# EAGLE design Aux Board (EAGLE 6.5.0)
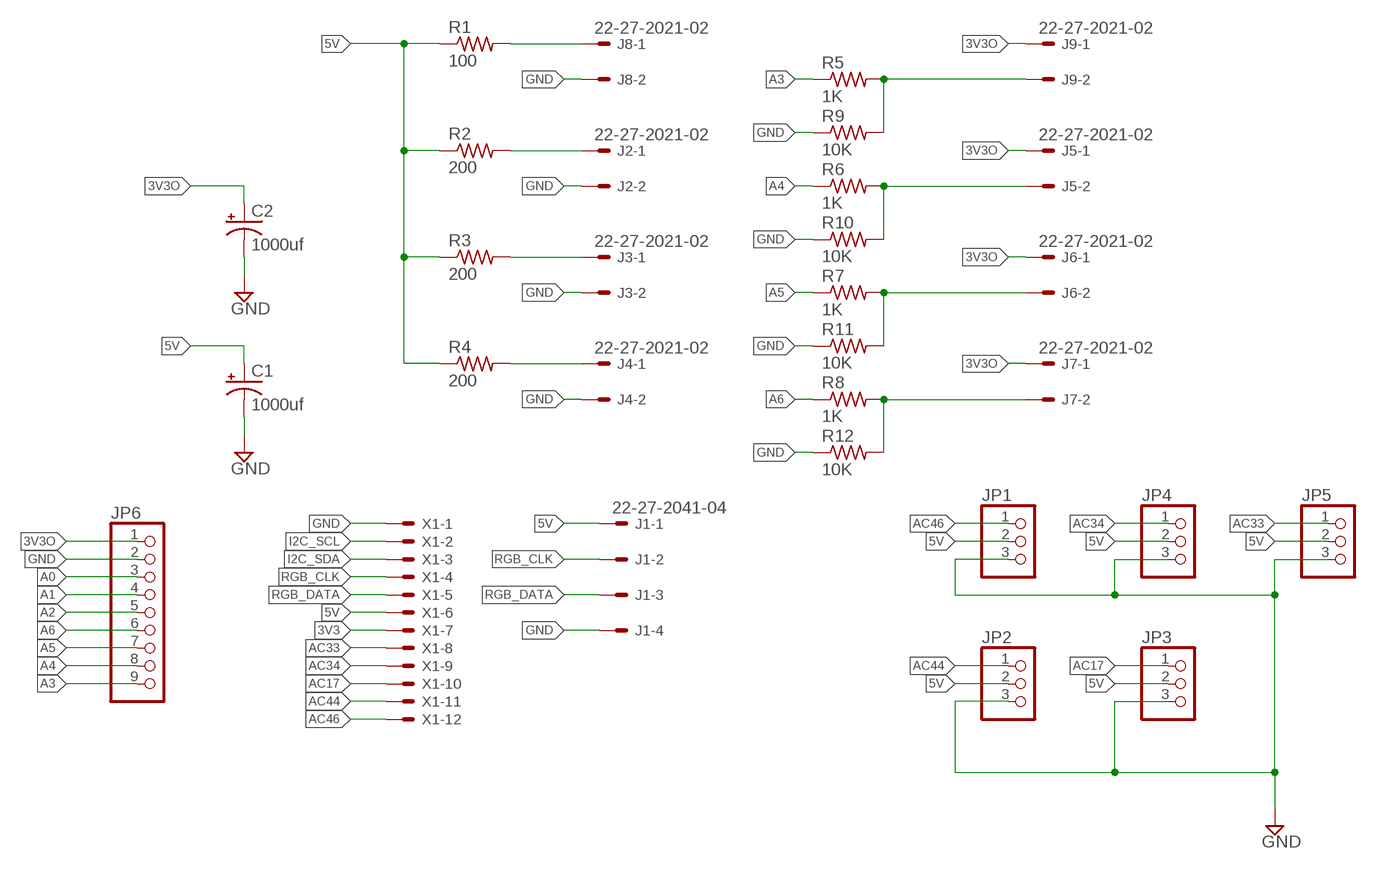
[diagram p0: schematic, sheet 1]

## Parts
C1  1000uf  CPOL-USE5-8.5  [E5-8,5]
C2  1000uf  CPOL-USE5-8.5  [E5-8,5]
J1  22-27-2041-04  [6410-04]
J2  22-27-2021-02  [6410-02]
J3  22-27-2021-02  [6410-02]
J4  22-27-2021-02  [6410-02]
J5  22-27-2021-02  [6410-02]
J6  22-27-2021-02  [6410-02]
J7  22-27-2021-02  [6410-02]
J8  22-27-2021-02  [6410-02]
J9  22-27-2021-02  [6410-02]
JP1  PINHD-1X3  [1X03]
JP2  PINHD-1X3  [1X03]
JP3  PINHD-1X3  [1X03]
JP4  PINHD-1X3  [1X03]
JP5  PINHD-1X3  [1X03]
JP6  PINHD-1X9  [1X09-BIG]
R1  100  R-US_0207/10  [0207/10]
R2  200  R-US_0207/10  [0207/10]
R3  200  R-US_0207/10  [0207/10]
R4  200  R-US_0207/10  [0207/10]
R5  1K  R-US_0207/10  [0207/10]
R6  1K  R-US_0207/10  [0207/10]
R7  1K  R-US_0207/10  [0207/10]
R8  1K  R-US_0207/10  [0207/10]
R9  10K  R-US_0207/10  [0207/10]
R10  10K  R-US_0207/10  [0207/10]
R11  10K  R-US_0207/10  [0207/10]
R12  10K  R-US_0207/10  [0207/10]
X1  KK-156-12  [KK-156-12]

## Nets
3V3: X1.7
3V3O: C2.+ J5.1 J6.1 J7.1 J9.1 JP6.1
5V: C1.+ J1.1 JP1.2 JP2.2 JP3.2 JP4.2 JP5.2 R1.1 R2.1 R3.1 R4.1 X1.6
A0: JP6.3
A1: JP6.4
A2: JP6.5
A3: JP6.9 R5.1
A4: JP6.8 R6.1
A5: JP6.7 R7.1
A6: JP6.6 R8.1
AC17: JP3.1 X1.10
AC33: JP5.1 X1.8
AC34: JP4.1 X1.9
AC44: JP2.1 X1.11
AC46: JP1.1 X1.12
GND: C1.- C2.- J1.4 J2.2 J3.2 J4.2 J8.2 JP1.3 JP2.3 JP3.3 JP4.3 JP5.3 JP6.2 R9.1 R10.1 R11.1 R12.1 X1.1
I2C_SCL: X1.2
I2C_SDA: X1.3
N$1: J7.2 R8.2 R12.2
N$3: J6.2 R7.2 R11.2
N$5: J5.2 R6.2 R10.2
N$8: J2.1 R2.2
N$9: J3.1 R3.2
N$11: J4.1 R4.2
N$14: J9.2 R5.2 R9.2
N$16: J8.1 R1.2
RGB_CLK: J1.2 X1.4
RGB_DATA: J1.3 X1.5

## Library data of the parts
C1 C2 = rcl:CPOL-US: POLARIZED CAPACITOR, American symbol
J1 = con-molex:22-?-04: CONNECTOR wire to board 2.54 mm (.1 inch) pitch header; OC_FARNELL: unknown; OC_NEWARK: unknown
J2-J9 = con-molex:22-?-02: CONNECTOR wire to board 2.54 mm (.1 inch) pitch header; OC_FARNELL: unknown; OC_NEWARK: unknown
JP1-JP5 = adafruit:PINHD-1X3: PIN HEADER
JP6 = adafruit:PINHD-1X9: Pin header 1x10 0.1" spacing With round pins
R1-R12 = resistor:R-US_: RESISTOR, American symbol
X1 = con-molex:KK-156-12: KK 156 HEADER Source: http://www.molex.com/pdm_docs/sd/026604100_sd.pdf; OC_FARNELL: unknown; OC_NEWARK: unknown

## Board
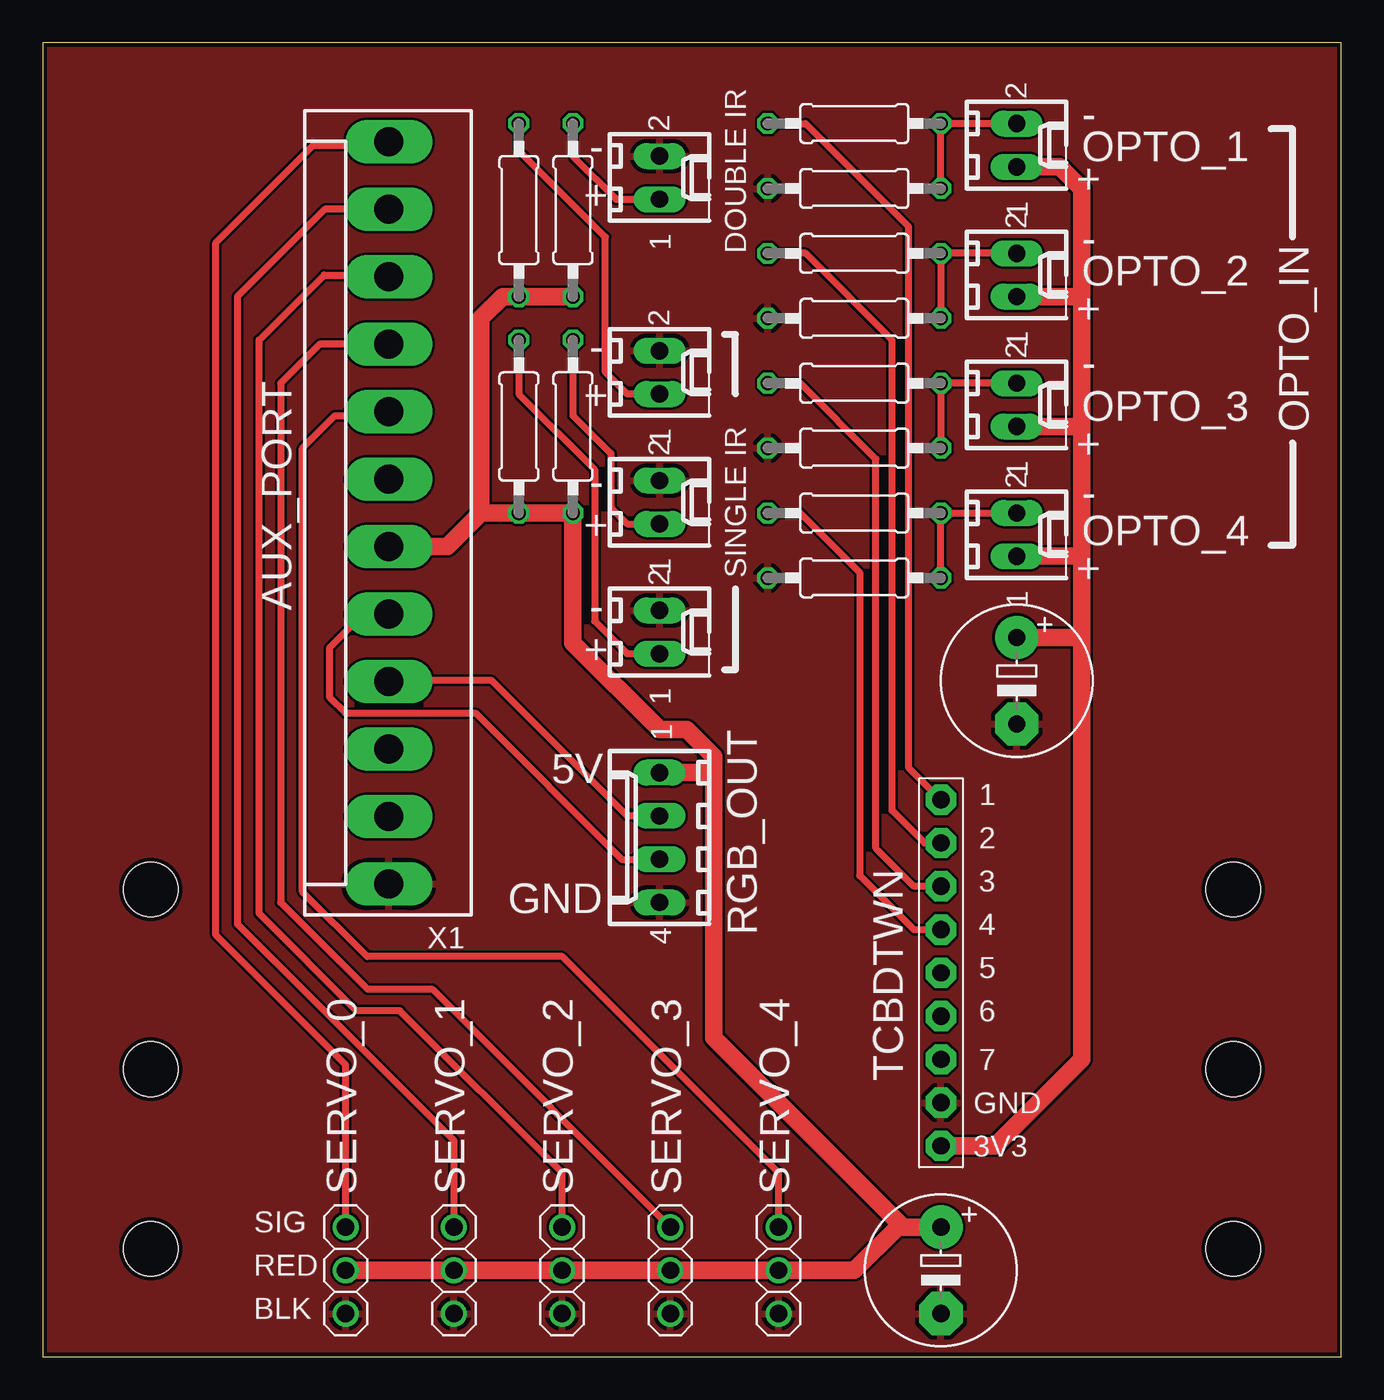
[diagram p1: board, top side]
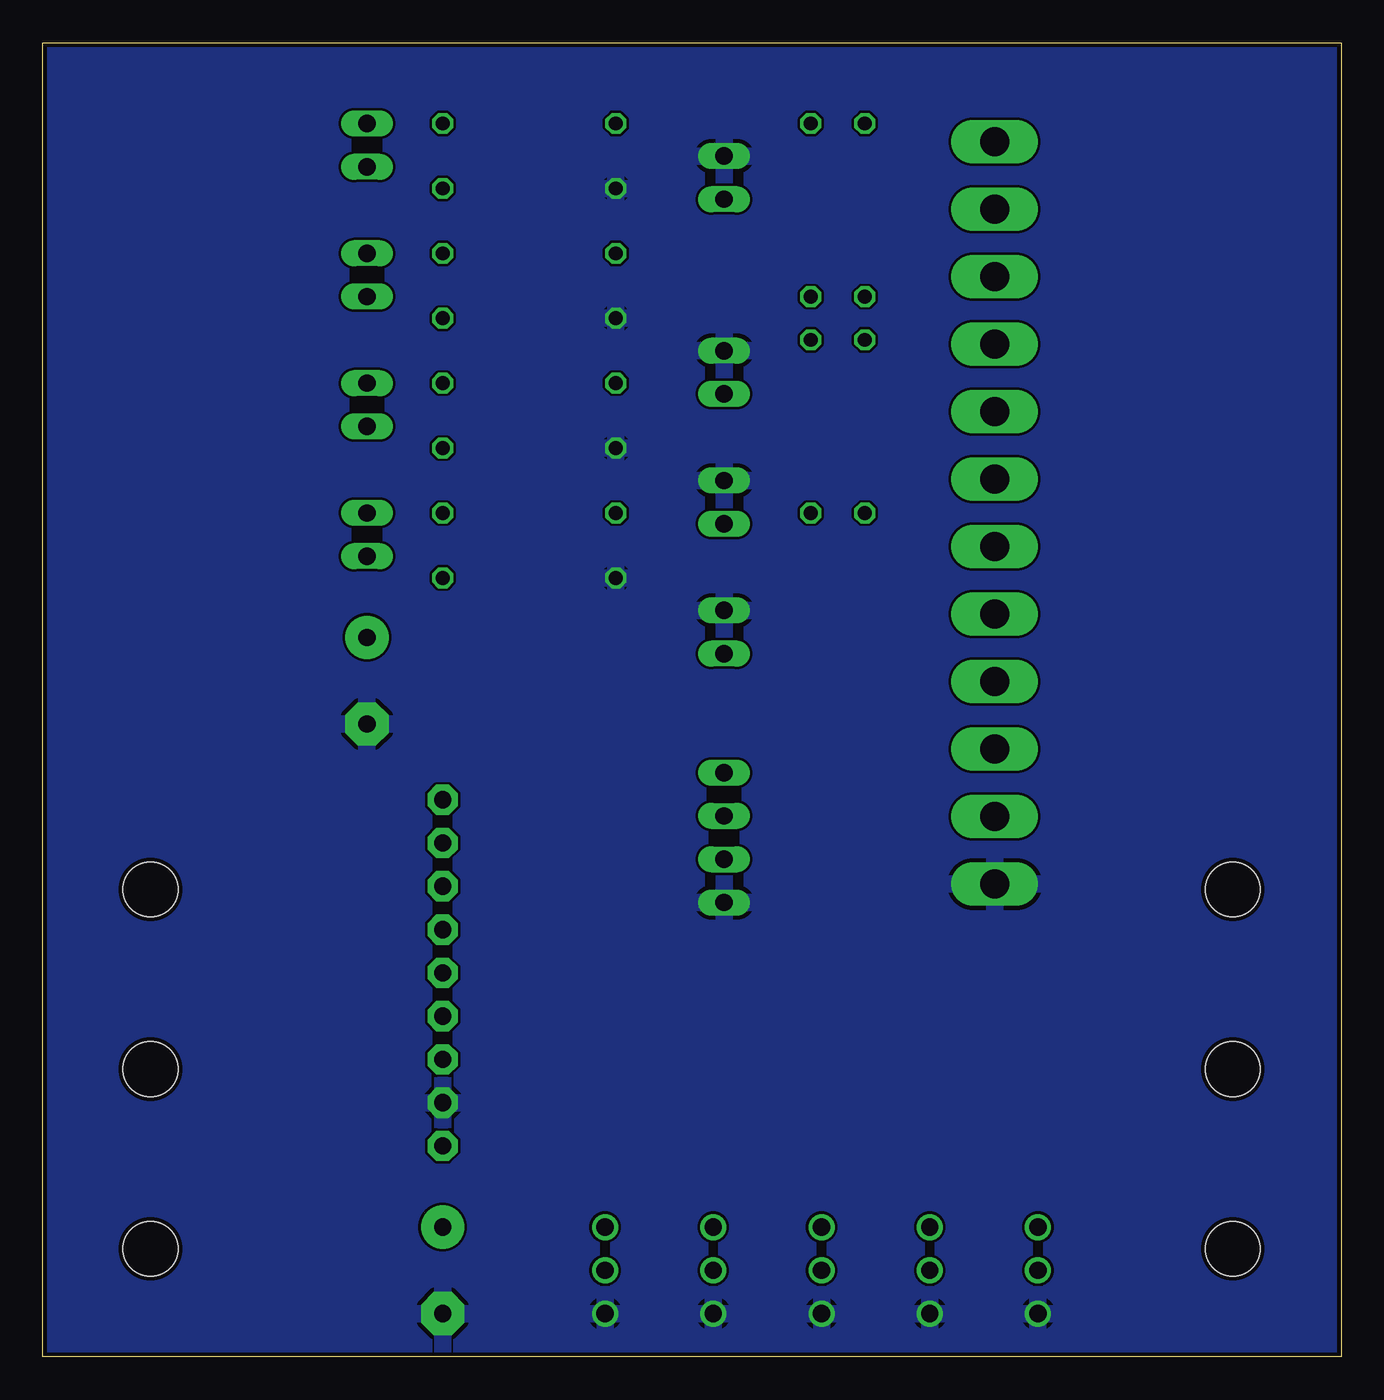
[diagram p2: board, bottom side, seen from below]

Size 76.18 x 77.14 mm. Coordinates in mm from the lower left corner, seen from the top.
Outline: 0,0 76.18,0 76.18,77.14 0,77.14 0,0
Copper layers (1*2*15*16): Top 0.035mm / dielectric 0.2mm / Route2 0.0175mm / dielectric 1.1mm / Route15 0.0175mm / dielectric 0.2mm / Bottom 0.035mm
Design rules "SeeedStudio_DRU_no_angle_20130527": minimum track width 6mil, minimum drill 12mil, track to track 6mil, track to pad 6mil, pad to pad 6mil, via to via 6mil, smd to smd 0mil, copper to edge 10mil, drill to drill 10mil, minimum pad ring 6mil, minimum via ring 6mil, stop-mask expansion 2mil, vias tented up to drill 25mil, thermal gap 10mil
Holes 3.2 mm at 6.35,6.35 6.35,16.89 6.35,27.43 69.85,6.35 69.85,16.89 69.85,27.43

### Footprints (pad centres in the part's own frame; a part is rotated, then mirrored left to right if it is on the bottom)
E5-8,5 = drill 1.016 pad 2.54: + -2.54,0 | drill 1.016 pad 2.54 octagon: - 2.54,0
6410-04 = drill 1.016 long: 1 3.81,0; 2 1.27,0; 3 -1.27,0; 4 -3.81,0
6410-02 = drill 1.016 long: 1 1.27,0; 2 -1.27,0
1X03 = drill 1.016: 1 -2.54,0; 2 0,0; 3 2.54,0
1X09-BIG = drill 1.016 pad 1.778 octagon: 1 -10.16,0; 2 -7.62,0; 3 -5.08,0; 4 -2.54,0; 5 0,0; 6 2.54,0; 7 5.08,0; 8 7.62,0; 9 10.16,0
0207/10 = drill 0.813 octagon: 1 -5.08,0; 2 5.08,0
KK-156-12 = drill 1.7 pad 2.184 long: 1 -21.78,0; 2 -17.82,0; 3 -13.86,0; 4 -9.9,0; 5 -5.94,0; 6 -1.98,0; 7 1.98,0; 8 5.94,0; 9 9.9,0; 10 13.86,0; 11 17.82,0; 12 21.78,0

### Placement (x,y rotation side)
C1  52.7,5.08 270 top
C2  57.15,39.69 270 top
J1  36.2,30.48 90 top
J2  36.2,57.78 270 top
J3  36.2,42.55 270 top
J4  36.2,50.16 270 top
J5  57.15,63.5 270 top
J6  57.15,55.88 270 top
J7  57.15,48.26 270 top
J8  36.2,69.22 270 top
J9  57.15,71.12 270 top
JP1  17.78,5.08 270 top
JP2  24.13,5.08 270 top
JP3  30.48,5.08 270 top
JP4  36.83,5.08 270 top
JP5  43.18,5.08 270 top
JP6  52.7,22.54 90 top
R1  31.11,67.31 90 top
R2  27.94,67.31 90 top
R3  27.94,54.61 90 top
R4  31.11,54.61 90 top
R5  47.62,72.39 0 top
R6  47.62,64.77 0 top
R7  47.62,57.15 0 top
R8  47.62,49.53 0 top
R9  47.62,68.58 0 top
R10  47.62,60.96 0 top
R11  47.62,53.34 0 top
R12  47.62,45.72 0 top
X1  20.32,49.53 90 top

### Tracks (layer width: path | path; a pad name or v marks a point on that pad's centre or on a via)
3V3O
  Top 1.016: JP6.1 55.88,12.38 60.96,17.46 60.96,42.23 | 60.96,42.23 60.96,46.67 | 60.96,46.67 60.96,54.29 | 60.96,54.29 60.96,62.23 | 60.96,62.23 60.96,68.58 59.69,69.85 J9.1 | J5.1 60.96,62.23 | J6.1 60.64,54.61 60.96,54.29 | J7.1 60.64,46.99 60.96,46.67 | C2.+ 60.96,42.23
5V
  Top 1.016: R1.1 R2.1 26.99,62.23 25.72,60.96 25.72,49.53 | X1.6 23.74,47.55 25.72,49.53 | 25.72,49.53 R3.1 R4.1 31.11,41.91 36.2,36.83 37.78,36.83 39.37,35.24 39.37,34.29 | 39.37,34.29 39.37,18.73 50.48,7.62 | 50.48,7.62 C1.+ | 50.48,7.62 50.16,7.62 47.62,5.08 JP5.2 | J1.1 39.37,34.29 | JP5.2 JP4.2 | JP5.2 JP3.2 JP2.2 JP1.2
A3
  Top 0.406: R5.1 44.77,72.39 50.8,66.36 50.8,34.61 JP6.9
A4
  Top 0.406: JP6.8 51.75,30.16 49.85,32.07 49.85,59.69 44.77,64.77 R6.1
A5
  Top 0.406: JP6.7 51.12,27.62 48.9,29.84 48.9,52.7 44.45,57.15 R7.1
A6
  Top 0.406: R8.1 44.45,49.53 47.94,46.04 47.94,28.26 51.12,25.08 JP6.6
AC17
  Top 0.406: JP3.1 30.48,10.79 20.95,20.32 18.41,20.32 12.7,26.04 12.7,59.69 16.51,63.5 20.21,63.5 X1.10
AC33
  Top 0.406: JP5.1 43.18,10.79 30.48,23.5 19.05,23.5 15.24,27.3 15.24,53.34 17.14,55.24 20.09,55.24 X1.8
AC34
  Top 0.406: X1.9 16.25,59.43 13.97,57.15 13.97,26.67 19.05,21.59 22.86,21.59 JP4.1
AC44
  Top 0.406: X1.11 16.55,67.35 11.43,62.23 11.43,25.4 24.13,12.7 JP2.1
AC46
  Top 0.406: JP1.1 17.78,17.14 10.16,24.77 10.16,65.41 15.88,71.12 20.32,71.12 X1.12
GND
  pour Top: -0.64,77.47 76.83,77.47 76.83,-0.64 -0.64,-0.64 -0.64,76.83
  pour Bottom: -0.95,77.79 77.15,77.79 77.15,-1.27 -0.95,-1.27
N$1
  Top 0.406: R12.2 R8.2 J7.2
N$3
  Top 0.406: J6.2 R7.2 R11.2
N$5
  Top 0.406: J5.2 R6.2 R10.2
N$8
  Top 0.406: J2.1 34.29,56.52 33.02,57.78 33.02,65.72 27.94,70.8 R2.2
N$9
  Top 0.406: R3.2 27.94,56.52 32.38,52.07 32.38,43.18 34.29,41.27 J3.1
N$11
  Top 0.406: R4.2 31.11,55.24 33.34,53.02 33.34,49.85 34.29,48.9 J4.1
N$14
  Top 0.406: J9.2 R5.2 R9.2
N$16
  Top 0.406: R1.2 31.11,70.48 33.66,67.94 J8.1
RGB_CLK
  Top 0.406: J1.2 34.29,31.75 26.35,39.69 20.38,39.69 X1.4
RGB_DATA
  Top 0.406: X1.5 18.82,43.59 16.83,41.59 16.83,38.73 17.78,37.78 25.4,37.78 33.97,29.21 J1.3

### Text on the board
tNames: - | - | OPTO_1 | + | + | DOUBLE IR | - | OPTO_2 | + | - | - | + | OPTO_3 | OPTO_IN | + | - | - | + | OPTO_4 | SINGLE IR | + | AUX_PORT | - | + | 5V | 1 | 2 | 3 | GND | RGB_OUT | 4 | 5 | 6 | 7 | TCBDTWN | GND | 3V3 | SERVO_0 | SERVO_1 | SERVO_2 | SERVO_3 | SERVO_4 | SIG | RED | BLK